# Altium schematic sheet Motor Driver 1.SchDoc
size A3; SheetNumber: 6; SheetTotal: 6
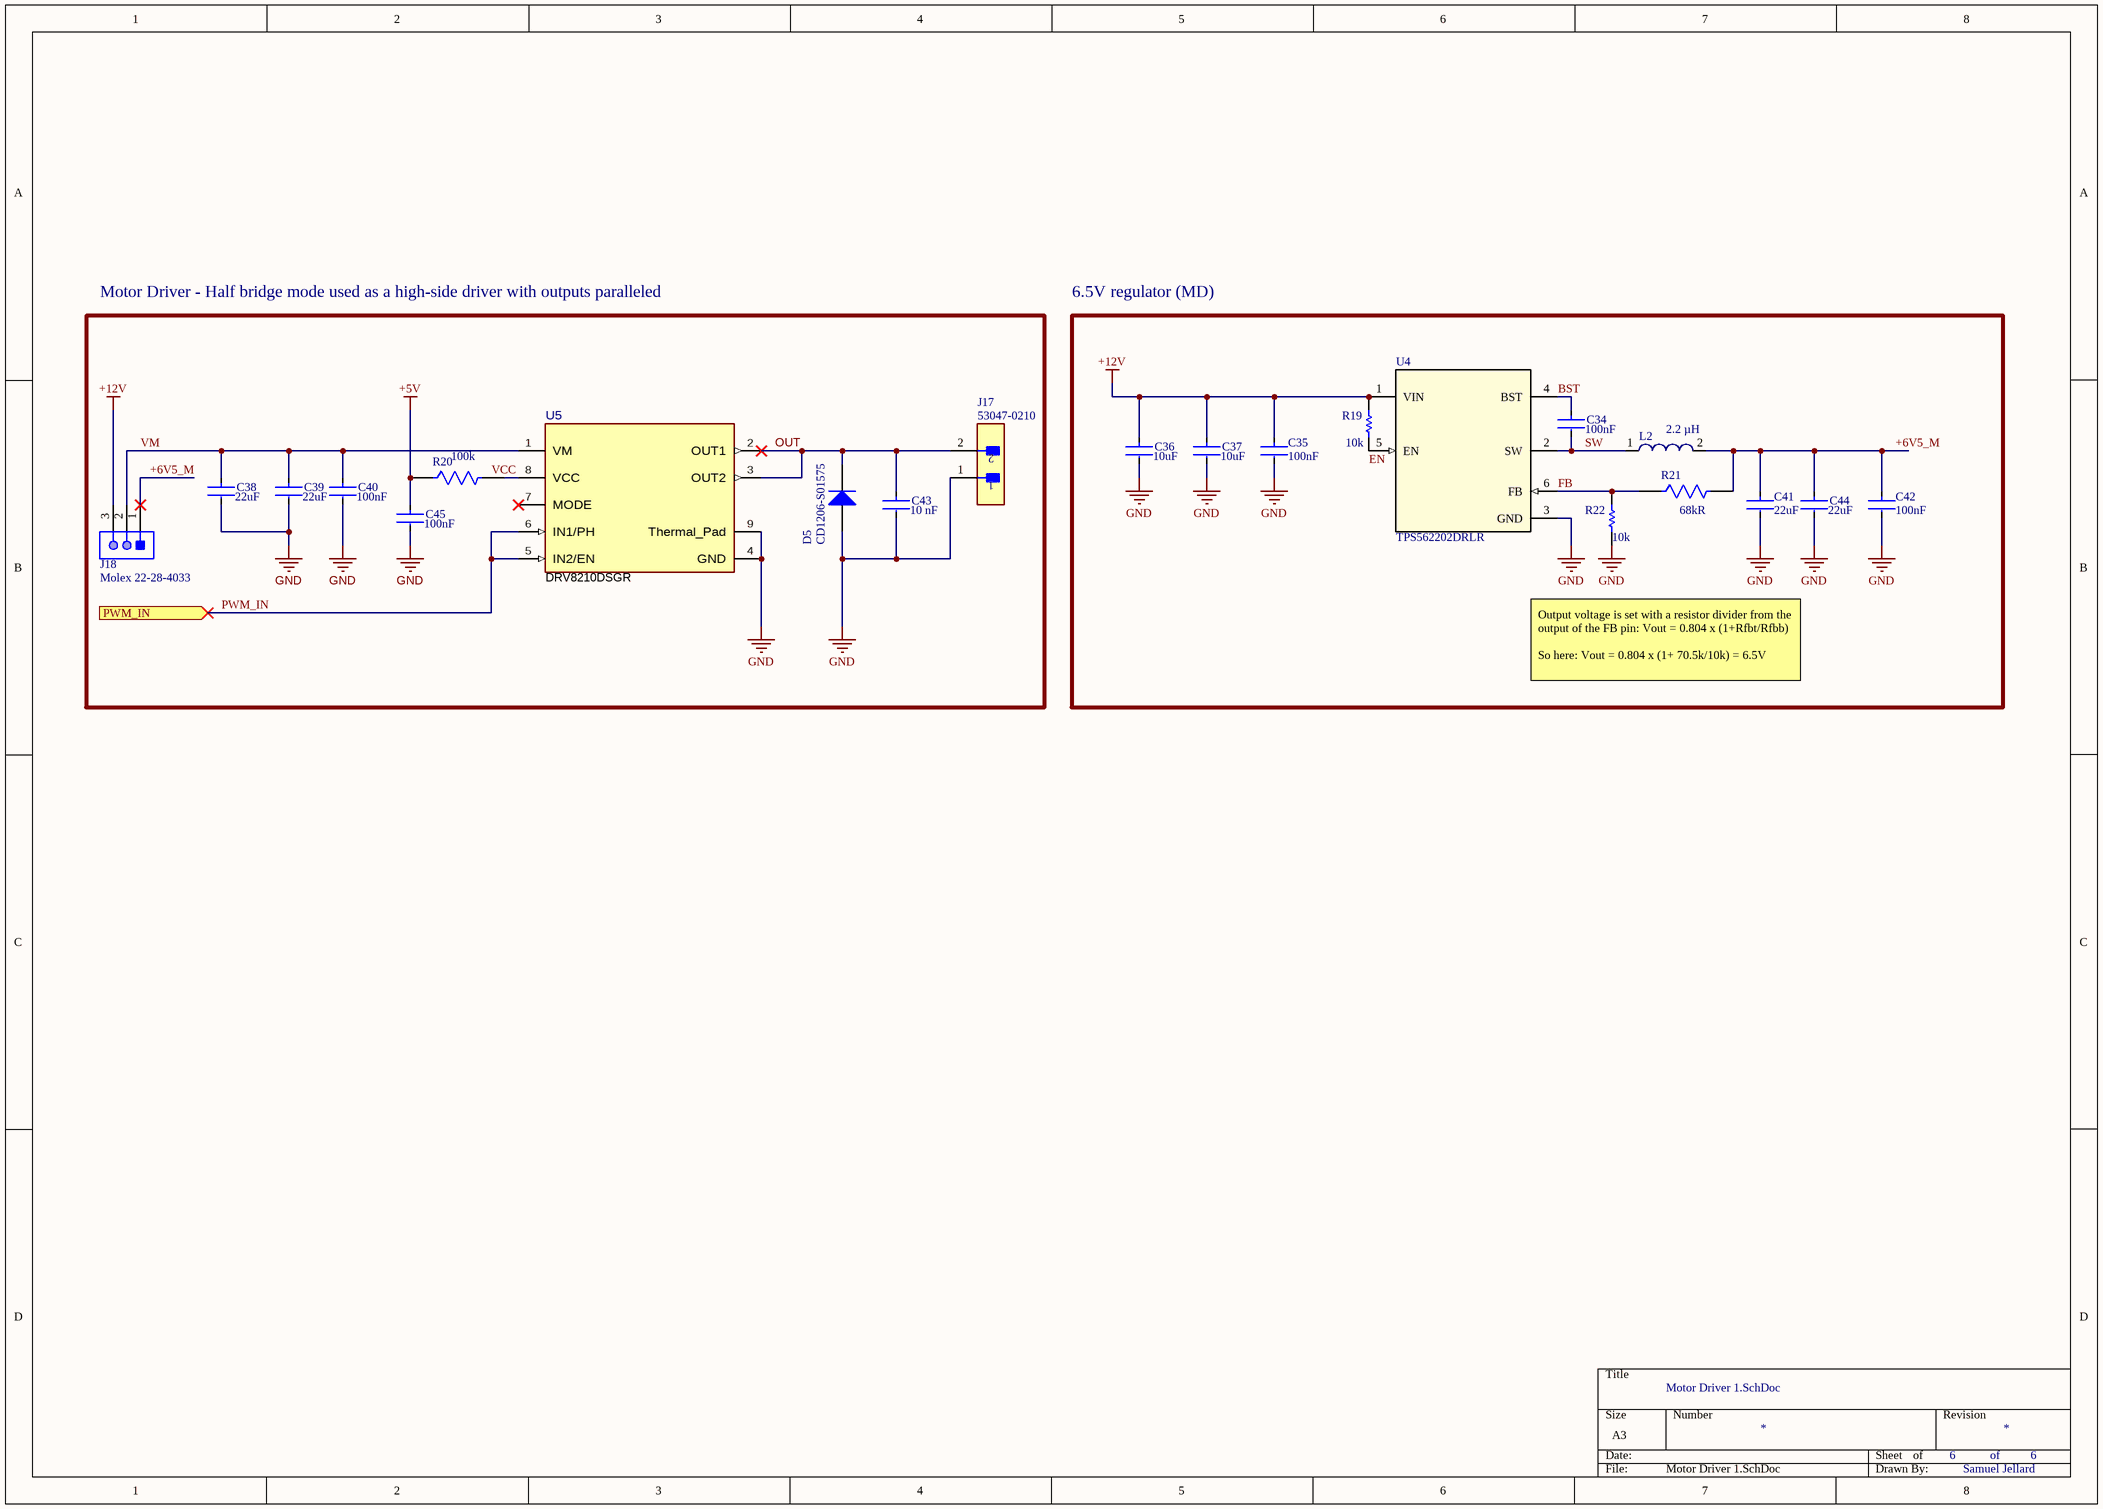
[diagram p0: Motor Driver 1.SchDoc]

## Parts
C34  Capacitance: 100nF  [FP-C1608-080-0_1-IPC_B]  (hidden comment: C1608X7R1E104K080AA)
C35  Capacitance: 100nF  [FP-C1608-080-0_1-IPC_B]  (hidden comment: C1608X7R1E104K080AA)
C36  Capacitance: 10uF  [FP-GRM21B-0_15-IPC_A]  (hidden comment: GRM21BR61E106MA73)
C37  Capacitance: 10uF  [FP-GRM21B-0_15-IPC_A]  (hidden comment: GRM21BR61E106MA73)
C38  value 22uF  [FP-GRM32-MFG]  (hidden comment: GRM32ER61E226KE15L)
C39  value 22uF  [FP-GRM32-MFG]  (hidden comment: GRM32ER61E226KE15L)
C40  Capacitance: 100nF  [FP-C0603-CG-IPC_B]  (hidden comment: C0603C104Z3VACTU)
C41  Capacitance: 22uF  [FP-GRM21B-0_2-e0_2_0_7-IPC_C]  (hidden comment: GRM21BR61A226ME44)
C42  Capacitance: 100nF  [FP-C1608-080-0_1-IPC_B]  (hidden comment: C1608X7R1E104K080AA)
C43  value 10 nF  [FP-CC0603-DA-MFG]  (hidden comment: CC0603KRX7R9BB103)
C44  Capacitance: 22uF  [FP-GRM21B-0_2-e0_2_0_7-IPC_C]  (hidden comment: GRM21BR61A226ME44)
C45  Capacitance: 100nF  [FP-C0603-CG-IPC_B]  (hidden comment: C0603C104Z3VACTU)
D5  CD1206-S01575  [BOUR-CD1206-S01575-2_L]
J17  53047-0210  [FP-53047-0210-MFG]
J18  Molex 22-28-4033  [MOLX-22-28-4033_V]
L2  Inductance: 2.2 µH  [WE-LHMI 7050]  (hidden comment: 74437349022)
R19  CRCW060310K0FKEA  [RESC1609X50X30NL8T20]  (value not drawn)
R20  Resistance: 100k  [FP-CRCW0603-e3-IPC_C]  (hidden comment: CRCW0603100KFKEA)
R21  Resistance: 68kR  [FP-CRCW0603-e3-MFG]  (hidden comment: CRCW060368K0FKEA)
R22  CRCW060310K0FKEA  [RESC1609X50X30NL8T20]  (value not drawn)
U4  TPS562202DRLR  [DRL0006A]
U5  PartNumber: DRV8210DSGR  [DSG0008A-MFG]  (hidden comment: SYM-DRV8210DSG)

## Blocks framed on the sheet
6.5V regulator (MD): C34-C37 C41 C42 C44 L2 R19 R21 R22 U4

## Ports
PWM_IN (in)

## Nets
+5V: C45.1 R20.1
+12V: C35.2 C36.1 C37.1 J18.3 R19.2 U4.1(VIN)
GND: C35.1 C36.2 C37.2 C38.2 C39.2 C40.2 C41.2 C42.1 C43.2 C44.2 C45.2 D5.1(A) J17.1 R22.1 U4.3(GND) U5.4(GND) U5.9(Thermal_Pad)
+6V5_M: C41.1 C42.2 C44.1 J18.1 L2.2 R21.2
BST: C34.2 U4.4(BST)
EN: R19.1 U4.5(EN)
FB: R21.1 R22.2 U4.6(FB)
OUT: C43.1 D5.2(K) J17.2 U5.2(OUT1) U5.3(OUT2)
PWM_IN: U5.5(IN2/EN) U5.6(IN1/PH) ; port PWM_IN
SW: C34.1 L2.1 U4.2(SW)
VM: C38.1 C39.1 C40.1 J18.2 U5.1(VM)
NetR20_2: R20.2 U5.8(VCC)

Not connected (* = marked no-connect by the designer): U5 7(MODE)*

## Notes on the sheet
- Motor Driver - Half bridge mode used as a high-side driver with outputs paralleled
- (near R19) 10k
- (near R22) 10k
- Output voltage is set with a resistor divider from the output of the FB pin: Vout = 0.804 x (1+Rfbt/Rfbb)
  So here: Vout = 0.804 x (1+ 70.5k/10k) = 6.5V
- of
- Samuel Jellard
- Labels drawn without touching a wire or pin: VCC

## Library data of the parts
C34 C35 C42 = CMP-2000-05395-2: Multilayer Ceramic Capacitors 100nF ±10% 25V X7R SMD 0603; Lead Free: Lead Free; REACH SVHC: No SVHC; Tolerance: 10%; Case Code (Metric): 1608; Packaging: Tape and Reel; Radiation Hardening: No; Dielectric: X7R; Height: 0.8mm; Width: 0.031inch; Voltage Rating (DC): 25V; Case Code (Imperial): 0603; Mount: Surface Mount; RoHS Compliant: Yes; Depth: 0.8mm; Min Operating Temperature: -55°C; Number of Pins: 2; Weight: 7.1E-05oz; Max Operating Temperature: 125°C; Dielectric Material: Ceramic; Resistor Type: Ceramic; Construction: Flat; Thickness: 0.037inch; Package Quantity: 1; Voltage Rating: 25V; Series: C; Voltage: 25V; Case/Package: 0603; Termination: SMD/SMT; Length: 1.6mm
C36 C37 = CMP-06035-013048-1: Chip Multilayer Ceramic Capacitors for General Purpose, 0805, 10uF, X5R, 15%, 20%, 25V; Max Operating Temperature: 85°C; Package Quantity: 3000; Case/Package: 0805; Depth: 1.25mm; Case Code (Imperial): 0805; Termination: SMD/SMT; Width: 0.049inch; Packaging: Tape and Reel; Tolerance: 20%; Height: 1.25mm; Min Operating Temperature: -55°C; Weight: 0.000335oz; Voltage Rating (DC): 25V; Dielectric: X5R; Length: 2mm; Thickness: 0.055inch; Voltage Rating: 25V; Resistor Type: Ceramic; Lead Free: Lead Free; Case Code (Metric): 2012; Mount: Surface Mount; REACH SVHC: No SVHC
C38 C39 = CMP-2000-05458-2: CAP CER 22UF 25V X5R 1210; Manufacturer: Murata Electronics North America; Possible Substitute: GRM32ER61E226KE15K; Other Names: 490-3889-2; Material: Ceramic; Tolerance: 10%; Digikey Description: CAP CER 22UF 25V X5R 1210; Mouser Description: Multilayer Ceramic Capacitors MLCC - SMD/SMT 1210 22uF 25volts X5R 10%; Device Class L2: Capacitors; Height: 2.7mm; Temperature Characteristic: X5R; Category: Cap; RoHS: TRUE; Operating Temperature: -55°C ~ 85°C; Temperature: -55°C to +85°C; Lead Free: Yes; Package: GRM32; Temperature Range High: +85°C; Package / Case: 1210 (3225 Metric); Standard Package: 1,000; Packaging: Cut Tape (CT); Capacitance: 22uF; Thickness (Max): 0.106" (2.70mm); Automotive: No; Device Class L1: Passive Components; Voltage - Rated: 25V; Temperature Range Low: -55°C; Size / Dimension: 0.126" L x 0.098" W (3.20mm x 2.50mm); ComponentLink2Description: Datasheet; Device Class L3: Ceramic Capacitors; Temperature Coefficient: X5R; ComponentLink2URL: https://search.murata.co.jp/Ceramy/image/img/A01X/G101/ENG/GRM32ER61E226KE15-01A.pdf; Voltage Rating: 25V; Manufacturer Part Number: GRM32ER61E226KE15L; Octopart: https://octopart.com/grm32er61e226ke15l-murata-197441; Applications: General Purpose; Mounting Type: Surface Mount, MLCC
C40 C45 = CMP-2006-03069-2: KEMET C0603C104Z3VACTU / CAP .10UF 25V CERAMIC Y5V 0603; Dissipation Factor: 7%; Tolerance: 80%; Depth: 0.8mm; Voltage Rating (DC): 25V; Number of Pins: 2; Dielectric: Y5V; Lead Pitch: 0.7mm; Construction: Flat; Max Operating Temperature: 85°C; Voltage Rating: 25V; Lead Free: Lead Free; Case/Package: 0603; RoHS Compliant: Yes; Length: 1.6mm; Mount: Surface Mount; Thickness: 0.034inch; Radiation Hardening: No; Case Code (Metric): 1608; Packaging: Tape and Reel; Series: C; Package Quantity: 1; Height: 0.8mm; Min Operating Temperature: -30°C; Termination: SMD/SMT; Dielectric Material: Ceramic; Width: 0.031inch; Case Code (Imperial): 0603; REACH SVHC: No SVHC; Voltage: 25V
C41 C44 = CMP-06035-039918-1: Chip Multilayer Ceramic Capacitors for General Purpose, 0805, 22uF, X5R, 15%, 20%, 10V; Dissipation Factor: 0.035%; Min Operating Temperature: -55°C; Voltage Rating (DC): 10V; Height: 1.25mm; Depth: 1.25mm; Max Operating Temperature: 85°C; Width: 1.25mm; Lead Free: Lead Free; Dielectric Material: Ceramic; Weight: 0.000335oz; Tolerance: 20%; Voltage Rating: 10V; Case Code (Metric): 2012; Termination: SMD/SMT; Length: 2mm; Thickness: 0.057inch; Case/Package: 0805; Packaging: Tape and Reel; Voltage: 10V; Case Code (Imperial): 0805; Resistor Type: Ceramic; Package Quantity: 3000; Mount: Surface Mount; Dielectric: X5R
C43 = CMP-2100-03600-2: SMD Multilayer Ceramic Capacitor, 10000 pF, 50 V, 0603 [1608 Metric], ± 10%, X7R,; Manufacturer: YAGEO; Tolerance: 0.1; Voltage Rating: 50 V; Temperature Coefficient: 15%; Mouser Description: Multilayer Ceramic Capacitor, CC Series, 0.01 - F, - 10%, X7R, 50 V, 0603 [1608 Metric]; Digikey Description: CAP CER 10000PF 50V X7R 0603; Height: 0.9mm; Category: Cap; Temperature Characteristic: X7R; Footprint Url: http://www.yageo.com/exep/pages/download/literatures/UPY-C_GEN_24.pdf; Lead Free: Yes; Manufacturer Part Number: CC0603KRX7R9BB103; Material: Ceramic; Temperature: -55°C to +125°C; Device Class L3: Ceramic Capacitors; ComponentLink2Description: Datasheet; Voltage: 50 V; Package: CC0603-DA; Octopart: https://octopart.com/cc0603krx7r9bb103-yageo-192938; Automotive: No; Temperature Range High: +125°C; Temperature Range Low: -55°C; RoHS: TRUE; Device Class L1: Passive Components; ComponentLink2URL: http://www.yageo.com/documents/recent/UPY-GPHC_X7R_6.3V-to-50V_18.pdf; Device Class L2: Capacitors; Capacitance: 10 nF
D5 = CMP-0583-00001-2: 75 V Small Signal Switching Diode, 150 mA, 2.5 uA, 1026 Molded Package, RoHS, Tape and Reel; Manufacturer: Bourns; Reverse Voltage: 75 V; Average Forward Current: 150 mA; Reverse Current (Max.): 2.5 uA; Capacitance Between Terminals (Max.): 3 pF; Reverse Recovery Time (Max.): 4 nS; Forward Voltage (Max.): 1.00 V; Packing: Tape and Reel; Mounting Technology: Surface Mount; DatasheetVersion: Rev. 06/11; ComponentLink2URL: http://www.bourns.com/data/global/pdfs/CD1206_S01575.pdf; PackageReference: CD1206-S01575-2; RoHS: TRUE; ComponentLink1URL: http://www.bourns.com/; ComponentLink1Description: Manufacturer URL; ComponentLink3Description: Package Specification; ComponentLink3URL: http://www.bourns.com/data/global/pdfs/CD1206_S01575.pdf; ComponentLink2Description: Datasheet; PackageDescription: 2-Pin SMD, Body 3.2 x 1.5 mm; PartNumber: CD1206-S01575
J17 = CMP-2000-05628-3: 1.25mm (.049") Pitch PicoBlade Wire-to-Board Header, Vertical, with Friction Lock, 2 Circuits; Manufacturer: Molex; Conn Gender: Male; Voltage Rating: 125V; Number Of Contacts: 2; Current Rating: 1A; Contact Material: Tin; Temperature Range Low: -40°C; ComponentLink2URL: http://www.molex.com/webdocs/datasheets/pdf/en-us/0530470210_PCB_HEADERS.pdf; Mouser Description: 1.25mm Pitch PicoBlade™ Wire-to-Board Header, Vertical, with Friction Lock, 2 Circuits; Manufacturer Part Number: 53047-0210; Temperature Range High: +85°C; ComponentLink2Description: Datasheet; Automotive: No; RoHS: TRUE; Ambient Temperature Range High: +85°C; Octopart: https://octopart.com/53047-0210-molex-276772; Footprint Url: https://www.molex.com/pdm_docs/sd/530470210_sd.pdf; Lead Free: Yes; Pitch: 1.25mm; Temperature: -40°C to +85°C; Conn Orientation: Vertical; Device Class L2: Headers and Wire Housings; Package: 0; Ambient Temperature Range Low: -40°C; Digikey Description: CONN HEADER VERT 2POS 1.25MM; Category: Conn; Device Class L3: unset; Number Of Rows: 1; Device Class L1: Connectors; Height: 4.4mm
J18 = CMP-1676-00001-5: Conn.; Rect./PCB; Header; 3 Cir.; Vertical; KK/254 Series; Gold Plating; Rows: 1; Voltage Rating: 250 V; Current Rating: 4 A; Min Operating Temperature: 0 degC; Lead Pitch: 0.1 inch; Packaging: Bulk; Contact Finish: Gold; RoHSCompliant: true; Contact Material: Brass; Manufacturer: Molex; PackageReference: 22-28-4033; REACH SVHC: Unknown; PackageDescription: Male Header, Pitch 2.54 mm, 1 x 3 Position, Height 8.38 mm, Tail Length 3.18 mm; ComponentLink2URL: http://www.molex.com/pdm_docs/sd/022284033_sd.pdf; Height: 8.38 mm; Mounting Technology: Through Hole; ComponentLink1Description: Manufacturer URL; Length: 7.62 mm; Mount: Through Hole; DatasheetVersion: Rev. G, 01/2012; Max Operating Temperature: 75 degC; ComponentLink2Description: Datasheet; Colour: Black; Pins: 3; Contact Plating: Gold; Package Quantity: 1; ComponentLink1URL: http://www.molex.com/
L2 = CMP-1353-00064-1: SMD Power Inductor WE-LHMI, L=2.2 µH; Manufacturer: Wuerth Elektronik; ComponentLink1Description: Manufacturer URL; ComponentLink2Description: Datasheet; PartNumber: 74437349022; ComponentLink2URL: http://katalog.we-online.de/kataloge/eisos/media/pdf/74437349022.pdf; ComponentLink1URL: http://www.we-online.com; PackageReference: WE-LHMI 7050
R19 R22 = CMP-1666-00005-4: Chip Resistor, 10 KOhm, +/- 1%, 100 mW, -55 to 155 degC, 0603 (1608 Metric), RoHS, Tape and Reel; Manufacturer: Vishay Semiconductor; Voltage Rating: 75 V; Max Operating Temperature: 155 degC; PackageDescription: 2-Pin Surface Mount Device, Body 1.575 x 0.85 mm; ComponentLink1Description: Manufacturer URL; RoHSCompliant: true; PackageReference: 0603; REACH SVHC: Unknown; Length: 1.55 mm; DatasheetVersion: 06/2012; Packaging: Tape and Reel; Min Operating Temperature: -55 degC; Mounting Technology: Surface Mount; ComponentLink2URL: https://datasheet.ciiva.com/11809/0900766b80d98afc-11809037.pdf; Height: 0.45 mm; ComponentLink2Description: Datasheet; Package Quantity: 5000; ComponentLink1URL: http://www.vishay.com/
R20 = CMP-2000-03820-2: RES Thick Film, 100kΩ, 1%, 0.1W, 100ppm/°C, 0603; Power Rating: 100mW; Voltage Rating (DC): 75V; Width: 0.033inch; Temperature Coefficient: 100ppm/°C; Case/Package: 0603; Max Operating Temperature: 155°C; Packaging: Tape and Reel; Number of Pins: 2; Termination: SMD/SMT; Case Code (Metric): 1608; Composition: Thick Film; Radiation Hardening: No; Min Operating Temperature: -55°C; Voltage Rating: 75V; Lead Free: Lead Free; Number of Terminations: 2; Height: 0.45mm; Case Code (Imperial): 0603; Features: Automotive AEC-Q200; Length: 1.55mm; Max Power Dissipation: 100mW; Package Quantity: 10; Military Standard: Not; Tolerance: 1%; Depth: 0.85mm; Contact Plating: Tin; Weight: 7.1E-05oz
R21 = CMP-1012-00717-3: RES Thick Film, 68kΩ, 1%, 0.1W, 100ppm/°C, 0603; Max Power Dissipation: 100mW; Voltage Rating (DC): 75V; Case Code (Metric): 1608; Termination: SMD/SMT; Tolerance: 1%; Case Code (Imperial): 0603; Radiation Hardening: No; Composition: Thick Film; Max Operating Temperature: 155°C; Features: Automotive AEC-Q200; Military Standard: Not; Contact Plating: Tin; Case/Package: 0603; Min Operating Temperature: -55°C; Power Rating: 100mW; Width: 0.033inch; Lead Free: Lead Free; Package Quantity: 10; Number of Terminations: 2; Mount: Surface Mount; Length: 1.55mm; Temperature Coefficient: 100ppm/°C; Packaging: Tape and Reel; Height: 0.45mm; Weight: 7.1E-05oz; Voltage Rating: 75V; Depth: 0.85mm; Number of Pins: 2
U4 = TPS562202DRLR: Switching Voltage Regulators 4.3-V to 17-V input, 2-A output, synchronous step-down voltage converter 6-SOT-5X3 -40 to 150; Mfr_Name: Texas Instruments; Type: DEV; RefDes: RefDes; Copyright: Copyright (C) 2021 Ultra Librarian. All rights reserved.; Manufacturer_Part_Number: TPS562202DRLR
U5 = SYM-DRV8210DSG: 11V, 1A H-bridge motor driver, PWM, PH/EN, ½ bridge control, with low power sleep mode; Manufacturer: Texas Instruments; Motor Type: Brushed; AEC Category: Q200; SizeZ_mm: 0.8mm; AEC Qualified: No; Min Supply Voltage: 1.65V; TJmax_C: +150°C; Switching Frequency: 100kHz; TaMax_C: +125°C; Number Of Outputs: 2; Standoff Height: 0mm; TaMin_C: -40°C; CompType: IC; ComponentLink3Description: Online Datasheet; Operating Temperature Range: -40°C to +150°C; RoHS: UNKNOWN; ComponentLink1Description: Datasheet Link; Max Supply Voltage: 11V; ComponentLink2URL: http://www.ti.com/product/GPN; ComponentLink3URL: http://www.ti.com/product/GPN/datasheet; PackageReference: WSON8; Part Number: DRV8210DSG; ComponentLink1URL: http://www.ti.com/lit/ds/symlink/GPN.pdf; helpURL: https://upverter.com/upn/revision/e8d31d71682e1798/; ComponentLink2Description: Product Folder; Datasheet Path: datasheets/IC-DRV8210DSG.pdf